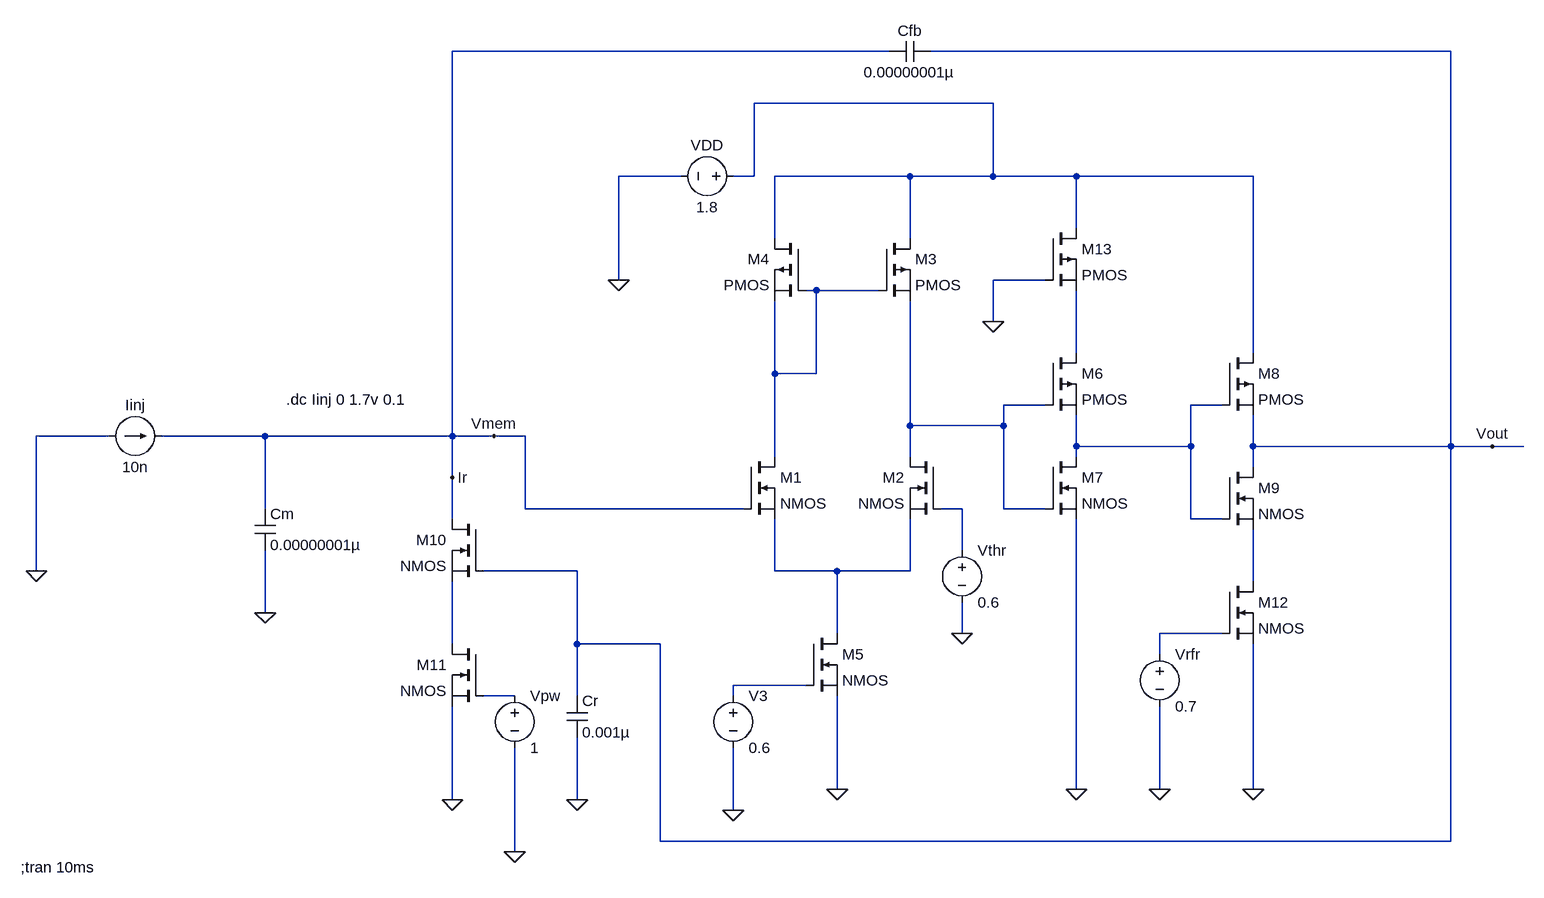
[diagram p0: schematic Neuron.asc]
Neuron.asc, the LTspice schematic file:
Version 4
SHEET 1 1568 824
WIRE 480 -448 -192 -448
WIRE 1344 -448 544 -448
WIRE 640 -368 272 -368
WIRE 160 -256 64 -256
WIRE 272 -256 272 -368
WIRE 272 -256 240 -256
WIRE 512 -256 304 -256
WIRE 640 -256 640 -368
WIRE 640 -256 512 -256
WIRE 768 -256 640 -256
WIRE 1040 -256 768 -256
WIRE 768 -176 768 -256
WIRE 304 -160 304 -256
WIRE 512 -160 512 -256
WIRE 64 -96 64 -256
WIRE 720 -96 640 -96
WIRE 368 -80 352 -80
WIRE 464 -80 368 -80
WIRE 640 -32 640 -96
WIRE 768 16 768 -80
WIRE 1040 16 1040 -256
WIRE 304 48 304 -64
WIRE 368 48 368 -80
WIRE 368 48 304 48
WIRE 720 96 656 96
WIRE 992 96 944 96
WIRE 512 128 512 -64
WIRE 656 128 656 96
WIRE 656 128 512 128
WIRE -720 144 -832 144
WIRE -480 144 -640 144
WIRE -192 144 -192 -448
WIRE -192 144 -480 144
WIRE -128 144 -192 144
WIRE -80 144 -128 144
WIRE 768 160 768 112
WIRE 944 160 944 96
WIRE 944 160 768 160
WIRE 1040 160 1040 112
WIRE 1344 160 1344 -448
WIRE 1344 160 1040 160
WIRE 1408 160 1344 160
WIRE 1456 160 1408 160
WIRE 304 176 304 48
WIRE 512 176 512 128
WIRE 768 176 768 160
WIRE 1040 192 1040 160
WIRE -192 208 -192 144
WIRE -480 256 -480 144
WIRE -80 256 -80 144
WIRE 256 256 -80 256
WIRE 592 256 560 256
WIRE 656 256 656 128
WIRE 720 256 656 256
WIRE -192 272 -192 208
WIRE 944 272 944 160
WIRE 992 272 944 272
WIRE 592 320 592 256
WIRE -832 352 -832 144
WIRE 0 352 -144 352
WIRE 304 352 304 272
WIRE 400 352 304 352
WIRE 512 352 512 272
WIRE 512 352 400 352
WIRE 1040 368 1040 288
WIRE -480 416 -480 320
WIRE 400 448 400 352
WIRE 592 448 592 400
WIRE 992 448 896 448
WIRE -192 464 -192 368
WIRE 0 464 0 352
WIRE 128 464 0 464
WIRE 896 480 896 448
WIRE 352 528 240 528
WIRE -96 544 -144 544
WIRE 0 544 0 464
WIRE 240 544 240 528
WIRE 400 688 400 544
WIRE 768 688 768 272
WIRE 896 688 896 560
WIRE 1040 688 1040 464
WIRE -192 704 -192 560
WIRE 0 704 0 608
WIRE 240 720 240 624
WIRE 128 768 128 464
WIRE 1344 768 1344 160
WIRE 1344 768 128 768
WIRE -96 784 -96 624
FLAG -480 416 0
FLAG 64 -96 0
FLAG -832 352 0
FLAG -96 784 0
FLAG 240 720 0
FLAG 640 -32 0
FLAG -128 144 Vmem
FLAG -192 208 Ir
FLAG 1408 160 Vout
FLAG 592 448 0
FLAG -192 704 0
FLAG 0 704 0
FLAG 400 688 0
FLAG 768 688 0
FLAG 896 688 0
FLAG 1040 688 0
SYMBOL nmos 256 176 R0
SYMATTR InstName M1
SYMBOL nmos 560 176 M0
SYMATTR InstName M2
SYMBOL pmos 352 -160 M0
SYMATTR InstName M4
SYMBOL pmos 464 -160 R0
SYMATTR InstName M3
SYMBOL nmos 352 448 R0
SYMATTR InstName M5
SYMBOL cap -496 256 R0
SYMATTR InstName Cm
SYMATTR Value 0.00000001µ
SYMBOL pmos 720 16 R0
SYMATTR InstName M6
SYMBOL nmos 720 176 R0
SYMATTR InstName M7
SYMBOL pmos 720 -176 R0
SYMATTR InstName M13
SYMBOL pmos 992 16 R0
SYMATTR InstName M8
SYMBOL nmos 992 192 R0
SYMATTR InstName M9
SYMBOL nmos 992 368 R0
SYMATTR InstName M12
SYMBOL cap 544 -464 R90
WINDOW 0 0 32 VBottom 2
WINDOW 3 32 32 VTop 2
SYMATTR InstName Cfb
SYMATTR Value 0.00000001µ
SYMBOL nmos -144 272 M0
SYMATTR InstName M10
SYMBOL nmos -144 464 M0
SYMATTR InstName M11
SYMBOL cap -16 544 R0
SYMATTR InstName Cr
SYMATTR Value 0.001µ
SYMBOL voltage 256 -256 R90
WINDOW 0 -32 56 VBottom 2
WINDOW 3 32 56 VTop 2
WINDOW 123 0 0 Left 0
WINDOW 39 0 0 Left 0
SYMATTR InstName VDD
SYMATTR Value 1.8
SYMBOL current -720 144 R270
WINDOW 0 32 40 VTop 2
WINDOW 3 -32 40 VBottom 2
WINDOW 123 0 0 Left 0
WINDOW 39 0 0 Left 0
SYMATTR InstName Iinj
SYMATTR Value 10n
SYMBOL voltage -96 528 R0
WINDOW 123 0 0 Left 0
WINDOW 39 0 0 Left 0
SYMATTR InstName Vpw
SYMATTR Value 1
SYMBOL voltage 240 528 R0
WINDOW 123 0 0 Left 0
WINDOW 39 0 0 Left 0
SYMATTR InstName V3
SYMATTR Value 0.6
SYMBOL voltage 896 464 R0
WINDOW 123 0 0 Left 0
WINDOW 39 0 0 Left 0
SYMATTR InstName Vrfr
SYMATTR Value 0.7
SYMBOL voltage 592 304 R0
WINDOW 123 0 0 Left 0
WINDOW 39 0 0 Left 0
SYMATTR InstName Vthr
SYMATTR Value 0.6
TEXT -856 808 Left 2 !;tran 10ms
TEXT -448 88 Left 2 !.dc Iinj 0 1.7v 0.1

The netlist it stands for:
* Neuron.asc
M1 N002 Ir N007 N007 NMOS
M2 N004 N006 N007 N007 NMOS
M4 N001 N002 N002 N002 PMOS
M3 N001 N002 N004 N004 PMOS
M5 N007 N011 0 0 NMOS
Cm Ir 0 0.00000001µ
M6 N003 N004 N005 N005 PMOS
M7 N005 N004 0 0 NMOS
M13 N001 0 N003 N003 PMOS
M8 N001 N005 Vout Vout PMOS
M9 Vout N005 N008 N008 NMOS
M12 N008 N009 0 0 NMOS
Cfb Vout Ir 0.00000001µ
M10 Ir Vout N010 N010 NMOS
M11 N010 N012 0 0 NMOS
Cr Vout 0 0.001µ
VDD N001 0 1.8
Iinj 0 Ir 10n
Vpw N012 0 1
V3 N011 0 0.6
Vrfr N009 0 0.7
Vthr N006 0 0.6
.model NMOS NMOS
.model PMOS PMOS
.lib standard.mos
;tran 10ms
.dc Iinj 0 1.7v 0.1
.backanno
.end